# Altium schematic sheet 400vMonitor.SchDoc
size A4
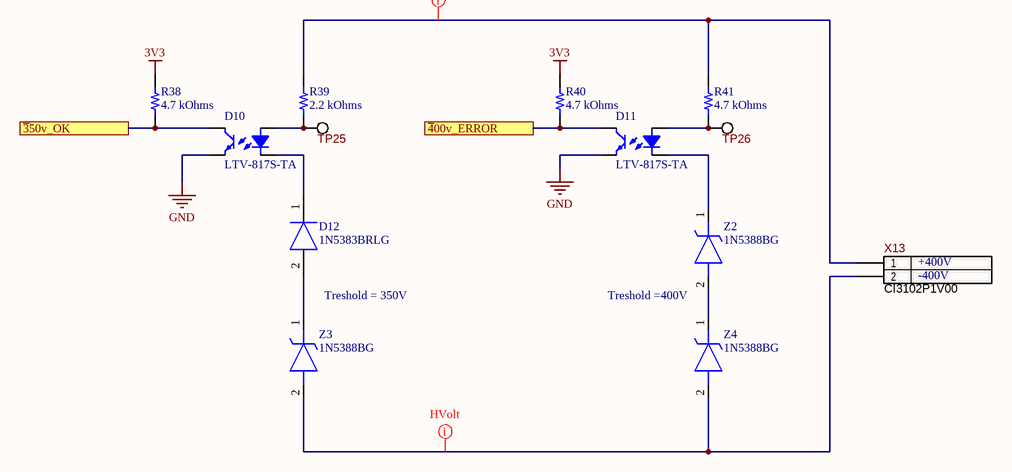
[diagram p0: 400vMonitor.SchDoc]

## Parts
D10  LTV-817S-TA  [LITEON LTV-817]
D11  LTV-817S-TA  [LITEON LTV-817]
D12  1N5383BRLG  [DIOAD2260W109L864D349]
R38  4.7 kOhms  [RES 0805_2012]
R39  2.2 kOhms  [RES 0805_2012]
R40  4.7 kOhms  [RES 0805_2012]
R41  4.7 kOhms  [RES 0805_2012]
TP25  PAD-1.1mm  [PAD-1.1mm]  (value not drawn)  (no BOM)
TP26  PAD-1.1mm  [PAD-1.1mm]  (value not drawn)  (no BOM)
X13  WH-02S  [WF-2S]  (value not drawn)
Z2  1N5388BG  [DIOAD2260W109L864D349]
Z3  1N5388BG  [DIOAD2260W109L864D349]
Z4  1N5388BG  [DIOAD2260W109L864D349]

## Ports
~{3}50v_OK, ~{4}00v_ERROR

## Nets
3V3: R38.2 R40.2
GND: D10.3 D11.3
~{3}50v_OK: D10.4 R38.1 ; port ~{3}50v_OK
~{4}00v_ERROR: D11.4 R40.1 ; port ~{4}00v_ERROR
NetD10_1: D10.1 R39.1 TP25.1
NetD10_2: D10.2 D12.1(K)
NetD11_1: D11.1 R41.1 TP26.1
NetD11_2: D11.2 Z2.1(K)
NetD12_2: D12.2(A) Z3.1(K)
NetR39_2: R39.2 R41.2 X13.1
NetX13_2: X13.2 Z3.2(A) Z4.2(A)
NetZ2_2: Z2.2(A) Z4.1(K)

## Layout directives
net class HVOLT: NetR39_2, NetX13_2

## Notes on the sheet
- (near X13) +400V
- (near X13) -400V
- Treshold = 350V
- Treshold =400V

## Library data of the parts
D10 D11 = LTV-817S-TA: OPTOISOLATR 5KV TRANSISTOR 4-SMD; Manufacturer: Lite-On Inc.; Current - DC Forward (If) (Max): 50mA; Current Transfer Ratio (Max): 600% @ 5mA; Current Transfer Ratio (Min): 50% @ 5mA; Input Type: DC; Number of Channels: 1; Rise / Fall Time (Typ): 4µs, 3µs; Vce Saturation (Max): 200mV; Voltage - Forward (Vf) (Typ): 1.2V; Voltage - Isolation: 5000Vrms; Voltage - Output (Max): 35V; Part Number: LTV-817S-TA; ComponentLink1Description: Datasheet; ComponentLink1URL: http://optoelectronics.liteon.com/upload/download/DS-70-96-0016/LTV-8X7%20series%20201610%20.pdf; ComponentLink2Description: DigiKey Link; ComponentLink2URL: http://digikey.com/product-detail/en/lite-on-inc/LTV-817S-TA/160-2038-1-ND/3711420; Current - Output / Channel: 50mA; Device Package: 4-SMD, Gull Wing; LastUpdated: 12.01.2020 21:59:02; Lifecycle Status: Active; Minimum Order: 1; Mounting Type: Surface Mount; Operating Temperature: -30°C ~ 110°C; Output Type: Transistor; Package / Case: 4-SMD, Gull Wing; Packaging: TapeAndReel; Part Status: Active; Price: 0.12; Series: -; Supplier 1: DigiKey; Supplier Part Number 1: 160-2038-1-ND; Supplier Device Package: 4-SMD
D12 = 1N5383BRLG: Diode; Manufacturer_Name: ON Semiconductor; Datasheet Link: https://datasheet.datasheetarchive.com/originals/distributors/Datasheets-23/DSA-455187.pdf; Manufacturer_Part_Number: 1N5383BRLG; Mouser Part Number: 863-1N5383BRLG; Mouser Price/Stock: https://www.mouser.co.uk/ProductDetail/onsemi/1N5383BRLG?qs=y2kkmE52mdNEksVZLCVE%252BQ%3D%3D; Arrow Part Number: 1N5383BRLG; Arrow Price/Stock: https://www.arrow.com/en/products/1n5383brlg/on-semiconductor
R38 R40 R41 = RCS08054K70JNEA: RES SMD 4.7K OHM 5% 0.4W 0805; Manufacturer: Vishay Dale; Power (Watts): 0.4W, 2/5W; Temperature Coefficient: ±200ppm/°C; Part Number: RCS08054K70JNEA; Value: 4.7 kOhms; ComponentLink1Description: Datasheet; ComponentLink1URL: http://www.vishay.com/docs/20065/rcse3.pdf; ComponentLink2Description: DigiKey Link; ComponentLink2URL: http://digikey.com/product-detail/en/vishay-dale/RCS08054K70JNEA/541-2866-1-ND/5867159; Composition: Thick Film; Device Package: 0805 (2012 Metric); Features: Automotive AEC-Q200, Pulse Withstanding; Height - Seated (Max): 0.020" (0.50mm); LastUpdated: 02.09.2020 01:15:24; Lifecycle Status: Active; Minimum Order: 1; Number of Terminations: 2; Operating Temperature: -55°C ~ 155°C; Package / Case: 0805 (2012 Metric); Packaging: TapeAndReel; PartId: 27839; Part Status: Active; Price: 0.02; Ratings: AEC-Q200; Resistance: 4.7 kOhms; Series: RCS e3; Size / Dimension: 0.079" L x 0.049" W (2.00mm x 1.25mm); Supplier 1: DigiKey; Supplier Part Number 1: 541-2866-1-ND; Supplier Device Package: 0805; Tolerance: ±5%
R39 = SR0805JR-7W2K2L: RES SMD 2.2K OHM 5% 1/4W 0805; Manufacturer: Yageo; Power (Watts): 0.25W, 1/4W; Temperature Coefficient: ±200ppm/°C; Part Number: SR0805JR-7W2K2L; Value: 2.2 kOhms; ComponentLink1Description: Datasheet; ComponentLink1URL: http://www.yageo.com/documents/recent/PYu-SR_20105_RoHS_L_8.pdf; ComponentLink2Description: DigiKey Link; ComponentLink2URL: http://digikey.com/product-detail/en/yageo/SR0805JR-7W2K2L/YAG6054CT-ND/9696508; Composition: Thick Film; Device Package: 0805 (2012 Metric); Features: Automotive AEC-Q200, Pulse Withstanding; Height - Seated (Max): 0.024" (0.60mm); LastUpdated: 02.09.2020 01:15:24; Lifecycle Status: Active; Minimum Order: 1; Number of Terminations: 2; Operating Temperature: -55°C ~ 155°C; Package / Case: 0805 (2012 Metric); Packaging: TapeAndReel; PartId: 27793; Part Status: Active; Price: 0.03; Ratings: AEC-Q200; Resistance: 2.2 kOhms; Series: SR; Size / Dimension: 0.079" L x 0.049" W (2.00mm x 1.25mm); Supplier 1: DigiKey; Supplier Part Number 1: YAG6054CT-ND; Supplier Device Package: 0805; Tolerance: ±5%
TP25 TP26 = PAD-1.1mm: 1.1mm Pad for Plug-In or Receptacle; Ajax_1C_PN: NONE; Ajax_1С_Status: RND Only; Component Status: Released; Lifecycle: ="Lifecycle"; Part Number: PAD-1.1mm; Component Type: PTH; Manufacturer: NONE; Part Type: Pad; Temperature Range: NONE; ComponentLink1URL: NONE; Replacement: NONE; Price: NONE; ComponentLink1Description: Datasheet
X13 = CI3102P1V00: WH Series 2.54mm Wire to Board Straight DIP Type Headers, 2 Pin; Manufacturer: CviLux; Ajax_1C_ID: 6817; Ajax_1C_PN: WF-02S (DS1070-2M) Штекер "папа"; 2 контакта; шаг 2.54мм; прямой; на плату; Ajax_1С_Status: RND Only; Component Status: Released; Replacement: NONE; GUID_1C: 74812bc3-35d6-11e5-ad28-a45d36c4a9e5; Part Number: CI3102P1V00; Part Type: Wire-to-Board / Header; Component Type: PTH; Temperature Range: -25℃ ~ 85℃; ComponentLink1URL: https://www.cvilux.com/uploads/drawings/100/723/CI3102S.pdf; Price: 0.08872458; ComponentLink1Description: Datasheet
Z2-Z4 = 1N5388BG: Zener Diode; Manufacturer_Name: ON Semiconductor; Datasheet Link: https://datasheet.datasheetarchive.com/originals/distributors/SFDatasheet-3/sf-00075052.pdf; Manufacturer_Part_Number: 1N5388BG; Mouser Part Number: 863-1N5388BG; Mouser Price/Stock: https://www.mouser.co.uk/ProductDetail/ON-Semiconductor/1N5388BG?qs=y2kkmE52mdMKKo8v3zoSgw%3D%3D; Arrow Part Number: 1N5388BG; Arrow Price/Stock: https://www.arrow.com/en/products/1n5388bg/on-semiconductor